# EAGLE schematic transmitter (EAGLE 7.7.0)
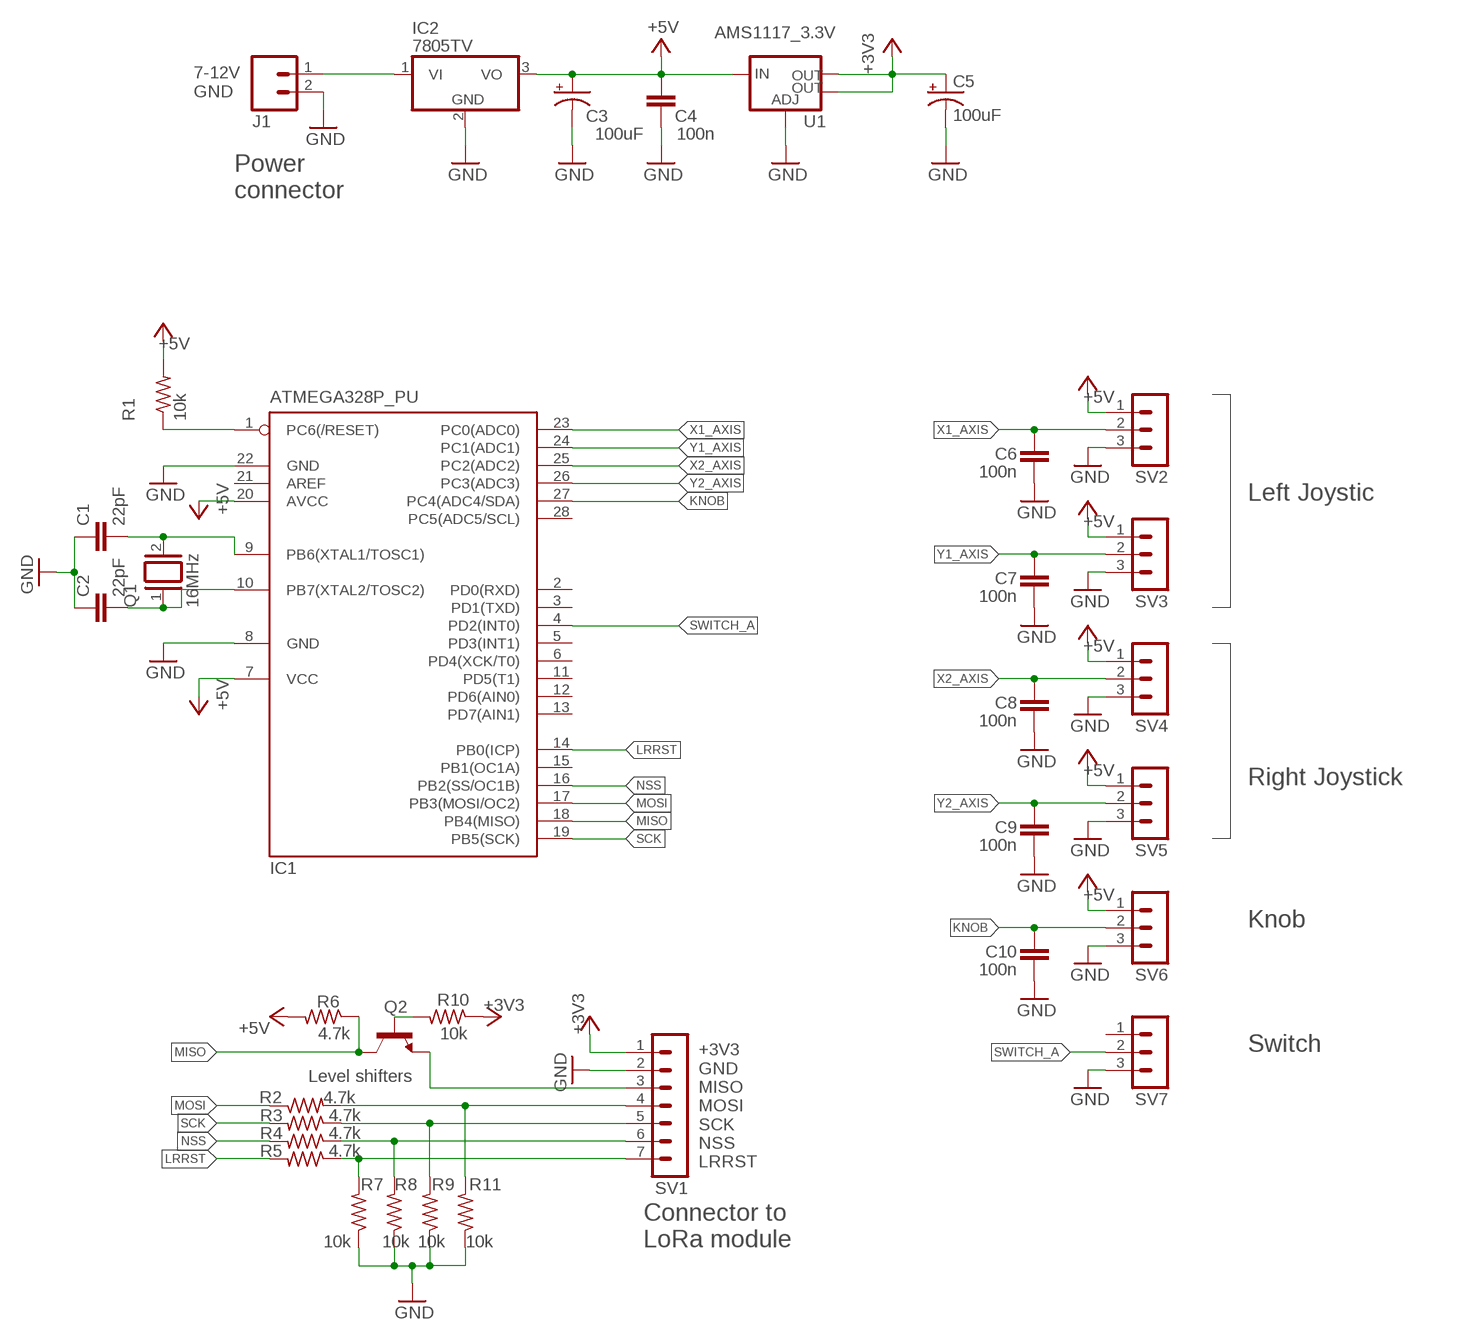
[diagram p0: schematic, sheet 1]

## Parts
C1  22pF  C-EU025-025X050  [C025-025X050]
C2  22pF  C-EU025-025X050  [C025-025X050]
C3  100uF  CPOL-USE2,5-6E  [E2,5-6E]
C4  100n  C-EU025-025X050  [C025-025X050]
C5  100uF  CPOL-USE2,5-6E  [E2,5-6E]
C6  100n  C-EU025-025X050  [C025-025X050]
C7  100n  C-EU025-025X050  [C025-025X050]
C8  100n  C-EU025-025X050  [C025-025X050]
C9  100n  C-EU025-025X050  [C025-025X050]
C10  100n  C-EU025-025X050  [C025-025X050]
IC1  ATMEGA328P_PU  MEGA8-P  [DIL28-3]
IC2  7805TV  [TO220V]
J1  M02PTH  [1X02]
Q1  16MHz  XTAL/S  [QS]
Q2  BC817-16SMD  [SOT23-BEC]
R1  10k  R-US_0204/5  [0204/5]
R2  4.7k  R-US_R0805  [R0805]
R3  4.7k  R-US_R0805  [R0805]
R4  4.7k  R-US_R0805  [R0805]
R5  4.7k  R-US_R0805  [R0805]
R6  4.7k  R-US_R0805  [R0805]
R7  10k  R-US_R0805  [R0805]
R8  10k  R-US_R0805  [R0805]
R9  10k  R-US_R0805  [R0805]
R10  10k  R-US_R0805  [R0805]
R11  10k  R-US_R0805  [R0805]
SV1  MA07-1  [MA07-1]
SV2  MA03-1  [MA03-1]
SV3  MA03-1  [MA03-1]
SV4  MA03-1  [MA03-1]
SV5  MA03-1  [MA03-1]
SV6  MA03-1  [MA03-1]
SV7  MA03-1  [MA03-1]
U1  AMS1117_3.3V  V_REG_LM1117SOT223  [SOT223]

## Nets
7-12V_IN: IC2.1(VI) J1.1
+3V3: C5.+ R10.1 SV1.1 U1.2(OUT) U1.4(OUT)
+5V: C3.+ C4.2 IC1.7(VCC) IC1.20(AVCC) IC2.3(VO) R1.2 R6.2 SV2.1 SV3.1 SV4.1 SV5.1 SV6.1 U1.3(IN)
GND: C1.1 C2.1 C3.- C4.1 C5.- C6.1 C7.1 C8.1 C9.1 C10.1 IC1.8(GND) IC1.22(GND) IC2.2(GND) J1.2 R7.1 R8.1 R9.1 R11.1 SV1.2 SV2.3 SV3.3 SV4.3 SV5.3 SV6.3 SV7.3 U1.1(ADJ)
KNOB: C10.2 SV6.2
LRRST: IC1.14(PB0(ICP)) R5.2
MASTER_RST1: IC1.1(PC6(/RESET)) R1.1
MISO: IC1.18(PB4(MISO)) Q2.C R6.1
MOSI: IC1.17(PB3(MOSI/OC2)) R2.1
N$1: Q2.B R10.2
N$2: Q2.E SV1.3
N$3: R3.1 R9.2 SV1.5
N$4: R2.2 R11.2 SV1.4
N$10: R4.1 R8.2 SV1.6
N$12: R5.1 R7.2 SV1.7
N$16: C1.2 IC1.9(PB6(XTAL1/TOSC1)) Q1.2
N$17: C2.2 IC1.10(PB7(XTAL2/TOSC2)) Q1.1
NSS: IC1.16(PB2(SS/OC1B)) R4.2
SCK: IC1.19(PB5(SCK)) R3.2
SWITCH_A: IC1.4(PD2(INT0)) SV7.2
X1_AXIS: C6.2 SV2.2
X2_AXIS: C8.2 SV4.2
Y1_AXIS: C7.2 SV3.2
Y2_AXIS: C9.2 SV5.2
Unconnected: IC1.2(PD0(RXD)) IC1.3(PD1(TXD)) IC1.5(PD3(INT1)) IC1.6(PD4(XCK/T0)) IC1.11(PD5(T1)) IC1.12(PD6(AIN0)) IC1.13(PD7(AIN1)) IC1.15(PB1(OC1A)) IC1.21(AREF) IC1.23(PC0(ADC0)) IC1.24(PC1(ADC1)) IC1.25(PC2(ADC2)) IC1.26(PC3(ADC3)) IC1.27(PC4(ADC4/SDA)) IC1.28(PC5(ADC5/SCL)) SV7.1

## Notes on the sheet
- 7-12V
  GND
- Power
  connector
- Left Joystic
- Right Joystick
- Knob
- Switch
- Level shifters
- +3V3
  GND
  MISO
  MOSI
  SCK
  NSS
  LRRST
- Connector to 
  LoRa module

## Library data of the parts
C1 C2 C4 C6-C10 = rcl:C-EU: CAPACITOR, European symbol
C3 C5 = rcl:CPOL-US: POLARIZED CAPACITOR, American symbol
IC1 = atmel:MEGA8-P: MICROCONTROLLER 8 Kbytes FLASH, 1 kbytes SRAM, 512 bytes EEPROM, USART, 4-channel 10 bit ADC, 2-channel 8 bit ADC Pin compatible with Atmega48, ATMega88, ATMega168 Source: avr.lbr; OC_FARNELL: unknown; OC_NEWARK: unknown
IC2 = linear:78*: Positive VOLTAGE REGULATOR Source: http://cache.national.com/ds/LM/LM78L05.pdf http://www.fairchildsemi.com/ds/LM/LM7805.pdf
J1 = SparkFun-Connectors:M02: Standard 2-pin 0.1" header. Use with - straight break away headers ( PRT-00116) - right angle break away headers (PRT-00553) - swiss pins (PRT-00743) - machine pins (PRT-00117) - female headers (PRT-00115) Molex polarized connector foot print use with: PRT-08233 with associated crimp pins and housings. 2.54_SCREWTERM for use with PRT-10571. 3.5mm Screw Terminal footprints for PRT-08084 5mm Screw Terminal footprints for use with PRT-08432
Q1 = special:XTAL/S: CRYSTAL
Q2 = transistor-npn:BC817*: NPN Transistor
R1-R11 = rcl:R-US_: RESISTOR, American symbol
SV1 = con-lstb:MA07-1: PIN HEADER; OC_FARNELL: unknown; OC_NEWARK: unknown
SV2-SV7 = con-lstb:MA03-1: PIN HEADER; OC_FARNELL: unknown; OC_NEWARK: unknown
U1 = SparkFun-PowerIC:V_REG_LM1117: Voltage Regulator LM1117 Standard adjustable voltage regulator but in SMD form. Spark Fun Electronics SKU : COM-00595; PROD_ID: VREG-08170